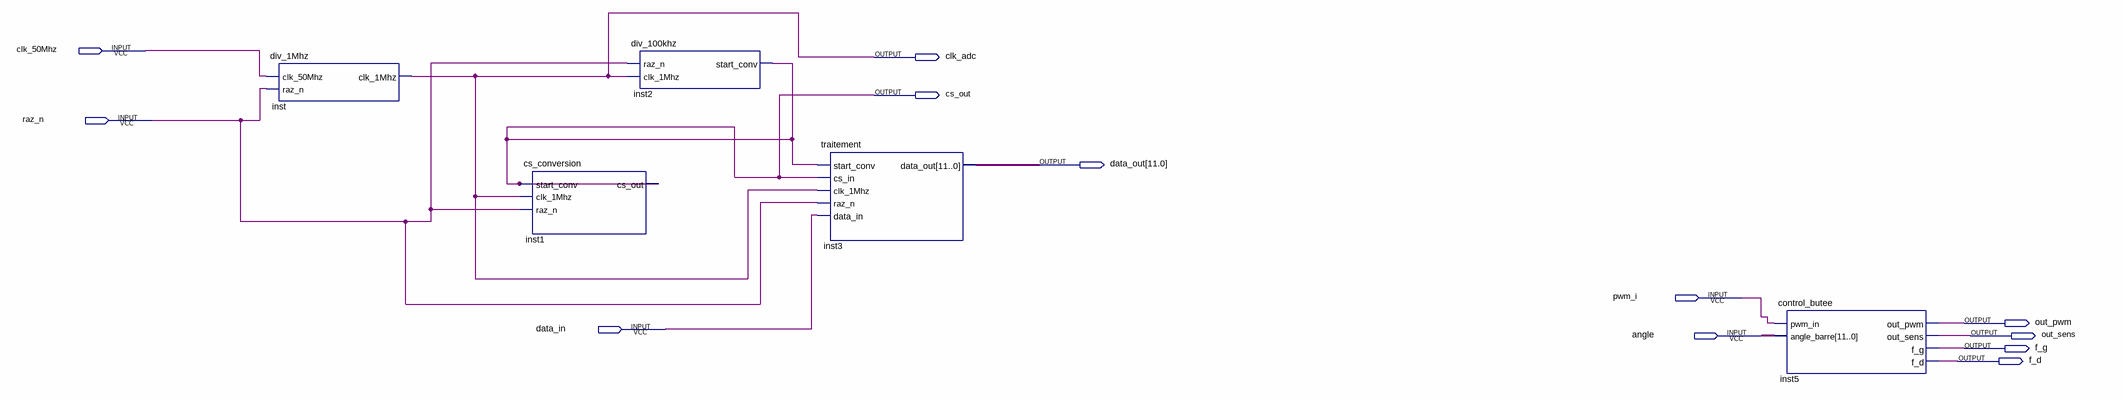
[diagram p0: schematic sheet]
// Quartus schematic traitement_verin.bdf as structural Verilog: 5 symbols, 12 pins
module traitement_verin (
  input  clk_50Mhz,
  input  raz_n,
  input  pwm_i,
  input  data_in,
  input  angle,
  output clk_adc,
  output cs_out,
  output \data_out[11.0] ,
  output out_pwm,
  output out_sens,
  output f_g,
  output f_d
);

  wire [11:0] inst3_data_out, undriven;

  div_1Mhz inst (.clk_50Mhz(clk_50Mhz), .raz_n(raz_n), .clk_1Mhz(clk_adc));
  cs_conversion inst1 (.start_conv(cs_out), .clk_1Mhz(clk_adc), .raz_n(raz_n), .cs_out(cs_out));
  div_100khz inst2 (.raz_n(raz_n), .clk_1Mhz(clk_adc), .start_conv(cs_out));
  traitement inst3 (
    .start_conv(cs_out), .cs_in(cs_out), .clk_1Mhz(clk_adc), .raz_n(raz_n), .data_in(data_in),
    .data_out(inst3_data_out));
  control_butee inst5 (
    .pwm_in(pwm_i), .angle_barre(undriven), .out_pwm(out_pwm), .out_sens(out_sens), .f_g(f_g), .f_d(f_d));
endmodule
